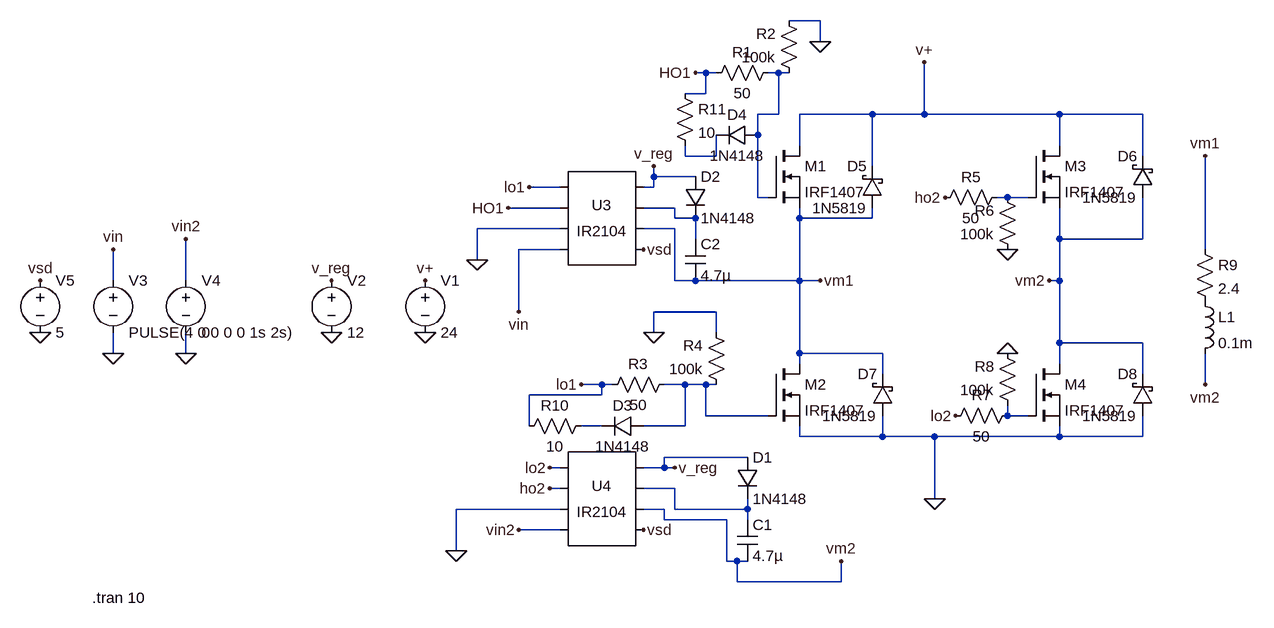
[diagram p0: schematic ltspice_H_bridge.asc]
ltspice_H_bridge.asc, the LTspice schematic file:
Version 4
SHEET 1 1232 776
WIRE 560 -128 512 -128
WIRE 560 -96 560 -128
WIRE 384 -48 368 -48
WIRE 400 -48 384 -48
WIRE 496 -48 480 -48
WIRE 512 -48 496 -48
WIRE 384 -16 384 -48
WIRE 384 -16 352 -16
WIRE 496 16 496 -48
WIRE 496 16 464 16
WIRE 640 16 528 16
WIRE 720 16 720 -64
WIRE 720 16 640 16
WIRE 928 16 720 16
WIRE 1056 16 928 16
WIRE 464 48 464 16
WIRE 528 64 528 16
WIRE 928 64 928 16
WIRE 352 80 352 64
WIRE 400 80 400 48
WIRE 400 80 352 80
WIRE 1056 80 1056 16
WIRE 640 96 640 16
WIRE 304 112 304 96
WIRE 368 112 304 112
WIRE 160 128 112 128
WIRE 304 128 304 112
WIRE 304 128 288 128
WIRE 464 144 464 48
WIRE 480 144 464 144
WIRE 848 144 832 144
WIRE 880 144 848 144
WIRE 160 160 80 160
WIRE 336 160 288 160
WIRE 336 176 336 160
WIRE 368 176 336 176
WIRE 528 176 528 160
WIRE 640 176 640 160
WIRE 640 176 528 176
WIRE 160 192 32 192
WIRE 336 192 288 192
WIRE 368 208 368 176
WIRE 928 208 928 160
WIRE 1056 208 1056 144
WIRE 1056 208 928 208
WIRE 160 224 96 224
WIRE 1152 224 1152 80
WIRE 32 240 32 192
WIRE -528 272 -528 224
WIRE -416 272 -416 208
WIRE 336 272 336 192
WIRE 368 272 336 272
WIRE 528 272 528 176
WIRE 528 272 368 272
WIRE 560 272 528 272
WIRE 928 272 928 208
WIRE 928 272 912 272
WIRE 96 320 96 224
WIRE 400 320 304 320
WIRE 304 352 304 320
WIRE 400 352 400 320
WIRE 928 368 928 272
WIRE 1056 368 928 368
WIRE -528 384 -528 352
WIRE -416 384 -416 352
WIRE 528 384 528 272
WIRE 656 384 528 384
WIRE 528 400 528 384
WIRE 928 400 928 368
WIRE 656 416 656 384
WIRE 1056 416 1056 368
WIRE 224 432 192 432
WIRE 240 432 224 432
WIRE 352 432 320 432
WIRE 384 432 352 432
WIRE 400 432 384 432
WIRE 1152 432 1152 384
WIRE 224 448 224 432
WIRE 224 448 112 448
WIRE 384 480 384 432
WIRE 480 480 384 480
WIRE 848 480 848 464
WIRE 880 480 848 480
WIRE 112 496 112 448
WIRE 224 496 192 496
WIRE 352 496 352 432
WIRE 352 496 288 496
WIRE 528 512 528 496
WIRE 656 512 656 480
WIRE 656 512 528 512
WIRE 736 512 656 512
WIRE 928 512 928 496
WIRE 928 512 736 512
WIRE 1056 512 1056 480
WIRE 1056 512 928 512
WIRE 448 544 320 544
WIRE 160 560 144 560
WIRE 320 560 320 544
WIRE 320 560 288 560
WIRE 336 560 320 560
WIRE 160 592 144 592
WIRE 336 592 288 592
WIRE 736 608 736 512
WIRE 160 624 0 624
WIRE 320 624 288 624
WIRE 336 624 336 592
WIRE 448 624 448 608
WIRE 448 624 336 624
WIRE 320 640 320 624
WIRE 416 640 320 640
WIRE 448 640 448 624
WIRE 160 656 96 656
WIRE 0 688 0 624
WIRE 416 704 416 640
WIRE 432 704 416 704
WIRE 448 704 432 704
WIRE 432 736 432 704
WIRE 592 736 592 704
WIRE 592 736 432 736
FLAG 736 608 0
FLAG -48 352 0
FLAG -48 272 v+
FLAG 720 -64 v+
FLAG -192 352 0
FLAG -192 272 v_reg
FLAG 304 96 v_reg
FLAG 336 560 v_reg
FLAG 0 688 0
FLAG 32 240 0
FLAG 80 160 HO1
FLAG 368 -48 HO1
FLAG 560 -96 0
FLAG 304 352 0
FLAG 112 128 lo1
FLAG 192 432 lo1
FLAG -528 384 0
FLAG -528 224 vin
FLAG 96 320 vin
FLAG -416 384 0
FLAG -416 208 vin2
FLAG 96 656 vin2
FLAG 848 384 0
FLAG 848 224 0
FLAG 560 272 vm1
FLAG 912 272 vm2
FLAG 768 480 lo2
FLAG 144 560 lo2
FLAG 752 144 ho2
FLAG 144 592 ho2
FLAG 1152 80 vm1
FLAG 1152 432 vm2
FLAG -640 352 0
FLAG -640 272 vsd
FLAG 288 656 vsd
FLAG 288 224 vsd
FLAG 592 704 vm2
SYMBOL nmos 480 64 R0
SYMATTR InstName M1
SYMATTR Value IRF1407
SYMBOL nmos 480 400 R0
SYMATTR InstName M2
SYMATTR Value IRF1407
SYMBOL nmos 880 64 R0
SYMATTR InstName M3
SYMATTR Value IRF1407
SYMBOL nmos 880 400 R0
SYMATTR InstName M4
SYMATTR Value IRF1407
SYMBOL voltage -48 256 R0
WINDOW 123 0 0 Left 0
WINDOW 39 0 0 Left 0
SYMATTR InstName V1
SYMATTR Value 24
SYMBOL voltage -192 256 R0
WINDOW 123 0 0 Left 0
WINDOW 39 0 0 Left 0
SYMATTR InstName V2
SYMATTR Value 12
SYMBOL cap 432 640 R0
SYMATTR InstName C1
SYMATTR Value 4.7µ
SYMBOL diode 432 544 R0
SYMATTR InstName D1
SYMATTR Value 1N4148
SYMBOL cap 352 208 R0
SYMATTR InstName C2
SYMATTR Value 4.7µ
SYMBOL diode 352 112 R0
SYMATTR InstName D2
SYMATTR Value 1N4148
SYMBOL res 496 -64 R90
WINDOW 0 0 56 VBottom 2
WINDOW 3 32 56 VTop 2
SYMATTR InstName R1
SYMATTR Value 50
SYMBOL res 528 -32 R180
WINDOW 0 36 76 Left 2
WINDOW 3 36 40 Left 2
SYMATTR InstName R2
SYMATTR Value 100k
SYMBOL res 336 416 R90
WINDOW 0 0 56 VBottom 2
WINDOW 3 32 56 VTop 2
SYMATTR InstName R3
SYMATTR Value 50
SYMBOL res 416 448 R180
WINDOW 0 36 76 Left 2
WINDOW 3 36 40 Left 2
SYMATTR InstName R4
SYMATTR Value 100k
SYMBOL voltage -528 256 R0
WINDOW 123 0 0 Left 0
WINDOW 39 0 0 Left 0
SYMATTR InstName V3
SYMATTR Value PULSE(4 0 0 0 0 1s 2s)
SYMBOL voltage -416 256 R0
WINDOW 123 0 0 Left 0
WINDOW 39 0 0 Left 0
SYMATTR InstName V4
SYMATTR Value 0
SYMBOL res 848 128 R90
WINDOW 0 0 56 VBottom 2
WINDOW 3 32 56 VTop 2
SYMATTR InstName R5
SYMATTR Value 50
SYMBOL res 864 240 R180
WINDOW 0 36 76 Left 2
WINDOW 3 36 40 Left 2
SYMATTR InstName R6
SYMATTR Value 100k
SYMBOL res 864 464 R90
WINDOW 0 0 56 VBottom 2
WINDOW 3 32 56 VTop 2
SYMATTR InstName R7
SYMATTR Value 50
SYMBOL res 864 480 R180
WINDOW 0 36 76 Left 2
WINDOW 3 36 40 Left 2
SYMATTR InstName R8
SYMATTR Value 100k
SYMBOL res 1136 208 R0
SYMATTR InstName R9
SYMATTR Value 2.4
SYMBOL voltage -640 256 R0
WINDOW 123 0 0 Left 0
WINDOW 39 0 0 Left 0
SYMATTR InstName V5
SYMATTR Value 5
SYMBOL diode 288 480 R90
WINDOW 0 0 32 VBottom 2
WINDOW 3 32 32 VTop 2
SYMATTR InstName D3
SYMATTR Value 1N4148
SYMBOL res 208 480 R90
WINDOW 0 0 56 VBottom 2
WINDOW 3 32 56 VTop 2
SYMATTR InstName R10
SYMATTR Value 10
SYMBOL diode 464 32 R90
WINDOW 0 0 32 VBottom 2
WINDOW 3 32 32 VTop 2
SYMATTR InstName D4
SYMATTR Value 1N4148
SYMBOL res 336 -32 R0
SYMATTR InstName R11
SYMATTR Value 10
SYMBOL ind 1136 288 R0
SYMATTR InstName L1
SYMATTR Value 0.1m
SYMBOL schottky 656 160 R180
WINDOW 0 24 64 Left 2
WINDOW 3 24 0 Left 2
SYMATTR InstName D5
SYMATTR Value 1N5819
SYMATTR Description Diode
SYMATTR Type diode
SYMBOL schottky 1072 144 R180
WINDOW 0 24 64 Left 2
WINDOW 3 24 0 Left 2
SYMATTR InstName D6
SYMATTR Value 1N5819
SYMATTR Description Diode
SYMATTR Type diode
SYMBOL schottky 672 480 R180
WINDOW 0 24 64 Left 2
WINDOW 3 24 0 Left 2
SYMATTR InstName D7
SYMATTR Value 1N5819
SYMATTR Description Diode
SYMATTR Type diode
SYMBOL schottky 1072 480 R180
WINDOW 0 24 64 Left 2
WINDOW 3 24 0 Left 2
SYMATTR InstName D8
SYMATTR Value 1N5819
SYMATTR Description Diode
SYMATTR Type diode
SYMBOL AutoGenerated\\IR2104 224 176 R0
SYMATTR InstName U3
SYMBOL AutoGenerated\\IR2104 224 608 R0
SYMATTR InstName U4
TEXT -560 760 Left 2 !.tran 10

The netlist it stands for:
* ltspice_H_bridge.asc
M1 v+ N001 vm1 vm1 IRF1407
M2 vm1 N005 0 0 IRF1407
M3 v+ N003 vm2 vm2 IRF1407
M4 vm2 N006 0 0 IRF1407
V1 v+ 0 24
V2 v_reg 0 12
C1 N008 vm2 4.7µ
D1 v_reg N008 1N4148
C2 N004 vm1 4.7µ
D2 v_reg N004 1N4148
R1 N001 HO1 50
R2 N001 0 100k
R3 N005 lo1 50
R4 N005 0 100k
V3 vin 0 PULSE(4 0 0 0 0 1s 2s)
V4 vin2 0 0
R5 N003 ho2 50
R6 0 N003 100k
R7 N006 lo2 50
R8 N006 0 100k
R9 vm1 P001 2.4
V5 vsd 0 5
D3 N005 N007 1N4148
R10 N007 lo1 10
D4 N001 N002 1N4148
R11 HO1 N002 10
L1 P001 vm2 0.1m
D5 vm1 v+ 1N5819
D6 vm2 v+ 1N5819
D7 0 vm1 1N5819
D8 0 vm2 1N5819
* U3: IR2104 (symbol AutoGenerated\IR2104 not available, pins judged from their places): pin1=lo1 pin2=HO1 pin3=0 pin4=vin pin5=v_reg pin6=N004 pin7=vm1 pin8=vsd
* U4: IR2104 (symbol AutoGenerated\IR2104 not available, pins judged from their places): pin1=lo2 pin2=ho2 pin3=0 pin4=vin2 pin5=v_reg pin6=N008 pin7=vm2 pin8=vsd
.model D D
.lib standard.dio
.model NMOS NMOS
.model PMOS PMOS
.lib standard.mos
.tran 10
.backanno
.end